# Altium project PDS Motherboard.PrjPcb
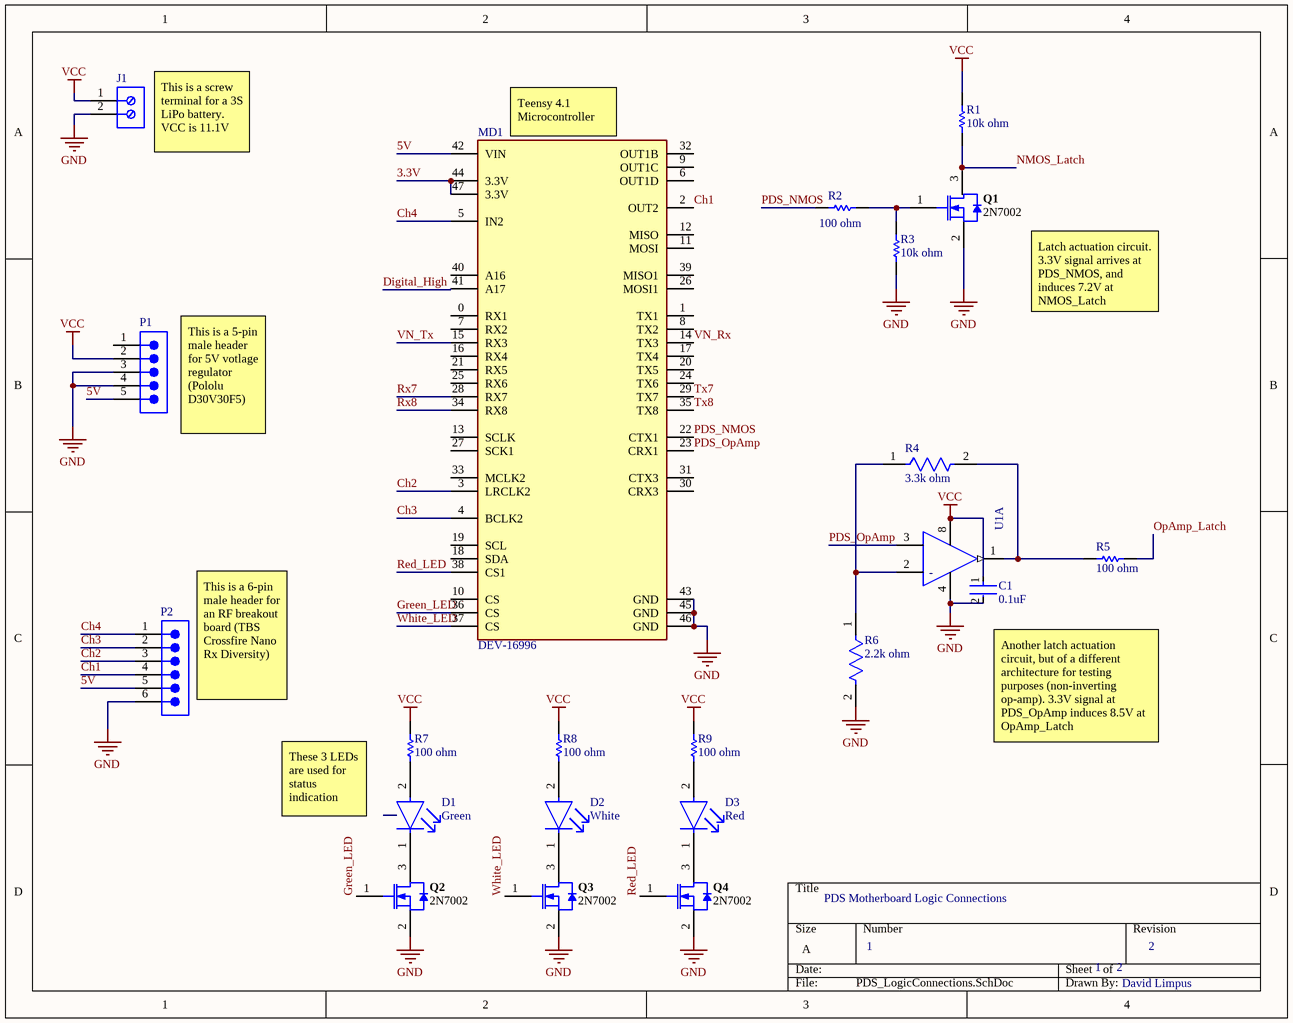
[diagram p0: PDS_LogicConnections.SchDoc]
2 sheets, 31 parts. Net scope: global (net labels, ports and power ports of the same name join across sheets).
Board file: PCB1.~(98).PcbDoc
Sheets:
  PDS_LogicConnections.SchDoc
  PDS_JSTConnections.SchDoc

## Sheet PDS_LogicConnections.SchDoc: PDS Motherboard Logic Connections
size A; DrawnBy: David Limpus; Revision: 2; SheetNumber: 1; SheetTotal: 2

### Parts
C1  0.1uF  [FP-C0603C-CF-MFG]
D1  Green  [FP-LTST-C190GKT-MFG]
D2  White  [FP-LTW-C191DS5-MFG]
D3  Red  [FP-LTST-C190EKT-MFG]
J1  1725656  [PHOE-1725656-2]  (value not drawn)
MD1  DEV-16996  [FP-DEV-16996-MFG]
P1  61300511121  [61300511121]  (value not drawn)
P2  61300611121  [61300611121]  (value not drawn)
Q1  2N7002  [INF-PG-SOT23_M]
Q2  2N7002  [INF-PG-SOT23_M]
Q3  2N7002  [INF-PG-SOT23_M]
Q4  2N7002  [INF-PG-SOT23_M]
R1  10k ohm  [RESC1609X50X30NL8T20]
R2  100 ohm  [RESC1609X50X30ML8T20]
R3  10k ohm  [RESC1609X50X30NL8T20]
R4  3.3k ohm  [FP-RG1608-MFG]
R5  100 ohm  [RESC1609X50X30ML8T20]
R6  2.2k ohm  [FP-RT0603-MFG]
R7  100 ohm  [RESC1609X50X30ML8T20]
R8  100 ohm  [RESC1609X50X30ML8T20]
R9  100 ohm  [RESC1609X50X30ML8T20]
U1  LM358DR  [FP-D0008A-MFG]  (value not drawn)  (part A of 2)

### Nets
GND: C1.2 J1.2 MD1.43(GND) MD1.45(GND) MD1.46(GND) P1.3 P1.4 P2.6 Q1.2(SOURCE) Q2.2(SOURCE) Q3.2(SOURCE) Q4.2(SOURCE) R3.2 R6.2 U1.4(V-)
VCC: C1.1 J1.1 P1.2 R1.1 R7.1 R8.1 R9.1 U1.8(V+)
3.3V: MD1.44(3.3V) MD1.47(3.3V)
5V: MD1.42(VIN) P1.5 P2.5
Ch1: MD1.2(OUT2) P2.4
Ch2: MD1.3(LRCLK2) P2.3
Ch3: MD1.4(BCLK2) P2.2
Ch4: MD1.5(IN2) P2.1
Digital_High: MD1.41(A17)
Green_LED: MD1.36(CS) Q2.1(GATE)
NMOS_Latch: Q1.3(DRAIN) R1.2
OpAmp_Latch: R5.2
PDS_NMOS: MD1.22(CTX1) R2.1
PDS_OpAmp: MD1.23(CRX1) U1.3(IN1+)
Red_LED: MD1.38(CS1) Q4.1(GATE)
Rx7: MD1.28(RX7)
Rx8: MD1.34(RX8)
Tx7: MD1.29(TX7)
Tx8: MD1.35(TX8)
VN_Rx: MD1.14(TX3)
VN_Tx: MD1.15(RX3)
White_LED: MD1.37(CS) Q3.1(GATE)
NetD1_1: D1.1(C) Q2.3(DRAIN)
NetD1_2: D1.2(A) R7.2
NetD2_1: D2.1(C) Q3.3(DRAIN)
NetD2_2: D2.2(A) R8.2
NetD3_1: D3.1(C) Q4.3(DRAIN)
NetD3_2: D3.2(A) R9.2
NetQ1_1: Q1.1(GATE) R2.2 R3.1
NetR4_1: R4.1 R6.1 U1.2(IN1-)
NetR4_2: R4.2 R5.1 U1.1(1OUT)

Not connected (* = marked no-connect by the designer): MD1 0(RX1) 1(TX1) 6(OUT1D) 7(RX2) 8(TX2) 9(OUT1C) 10(CS) 11(MOSI) 12(MISO) 13(SCLK) 16(RX4) 17(TX4) 18(SDA) 19(SCL) 20(TX5) 21(RX5) 24(TX6) 25(RX6) 26(MOSI1) 27(SCK1) 30(CRX3) 31(CTX3) 32(OUT1B) 33(MCLK2) 39(MISO1) 40(A16); P1 1

### Notes on the sheet
- (near J1) This is a screw terminal for a 3S LiPo battery. VCC is 11.1V
- (near MD1) Teensy 4.1 Microcontroller
- Latch actuation circuit. 3.3V signal arrives at PDS_NMOS, and induces 7.2V at NMOS_Latch
- (near P1) This is a 5-pin male header for 5V votlage regulator (Pololu D30V30F5)
- (near P2) This is a 6-pin male header for an RF breakout board (TBS Crossfire Nano Rx Diversity)
- (near C1) Another latch actuation circuit, but of a different architecture for testing purposes (non-inverting op-amp). 3.3V signal at PDS_OpAmp induces 8.5V at OpAmp_Latch
- These 3 LEDs are used for status indication
- PDS Motherboard Logic Connections
- 1
- 2
- David Limpus
- (in symbol CMP-1685-00009-2, part A) -

### Library data of the parts
C1 = CMP-2006-03061-2: CAP CER 0.1UF 50V X7R 0603; Manufacturer: KEMET; Manufacturer Part Number: C0603C104K5RACTU; Tolerance: 0.1; Temperature Coefficient: 30ppm/°C; Material: Ceramic; Automotive Grade: Grade 1; Value: 0.10 μF; Temperature: -55°C to +125°C; RoHS: TRUE; Temperature Range High: +125°C; Lead Free: Yes; Octopart: https://octopart.com/c0603c104k5ractu-kemet-139244; Digikey Description: CAP CER 0.1UF 50V X7R 0603; Category: Cap; Package: C0603C-CF; ComponentLink2Description: Datasheet; Temperature Range Low: -55°C; Device Class L1: Passive Components; Voltage Rating: 50 V; Automotive: Yes; Device Class L3: Ceramic Capacitors; ComponentLink2URL: https://api.kemet.com/component-edge/download/datasheet/C0603C100J5GACAUTO.pdf; Capacitance: 0.10 μF; Device Class L2: Capacitors; Temperature Characteristic: X7R; Height: 0.87mm
D1 = CMP-22017-000005-2: LED GREEN CLEAR CHIP SMD; Dominant Wavelength: 569nm; Reverse Voltage: 5V; Lens Color: Colorless; Viewing Angle: 130°; Voltage: 2V; Forward Current: 30mA; Power Dissipation: 100mW; Luminous Intensity: 6mcd; Number of LEDs: 1; Forward Voltage: 2.1V; Wavelength: 565nm; Test Current: 10mA; Min Operating Temperature: -55°C; Lens Style: Clear; Mount: Surface Mount; Width: 0.8mm; Packaging: Tape and Reel; Lens Transparency: Clear; Case Code (Metric): 1608; Depth: 0.8mm; Case Code (Imperial): 0603; Case/Package: 0603; Number of Pins: 2; Max Operating Temperature: 85°C; Lead Free: Lead Free; Number of Elements: 1; Length: 1.6mm; Height: 0.8mm; Package Quantity: 1; Power Rating: 100mW; Radiation Hardening: No; Illumination Color: Green; Color: Green
D2 = CMP-22017-000001-1: LED WHITE CHIP SMD; Manufacturer Part Number: LTW-C191DS5; Manufacturer: Lite-On; Luminous Intensity: 71-180mcd; Forward Voltage: 3.15V; Led Orientation: Top View; Power Dissipation: 72mW; Forward Current: 20mA; Viewing Angle: 130°; Reverse Voltage: 5V; Device Class L3: unset; Category: Diode; Height: 0.65mm; Octopart: https://octopart.com/ltw-c191ds5-lite-on-9287539; Device Class L1: Optoelectronics; ComponentLink2URL: http://optoelectronics.liteon.com/upload/download/DS22-2006-062/LTW-C191DS5.PDF; Digikey Description: LED WHITE CHIP SMD; Colour: White; RoHS: TRUE; Temperature: -30°C to +85°C; Automotive: No; Lead Free: Yes; Temperature Range Low: -30°C; Device Class L2: LEDs; Package: LTW-C191DS5; Mouser Description: Standard LEDs - SMD White 65mcd; ComponentLink2Description: Datasheet; Temperature Range High: +85°C
D3 = CMP-22017-000021-1: LED RED CLEAR CHIP SMD; Power Dissipation: 100mW; Lens Color: Colorless; Viewing Angle: 130°; Wavelength: 630nm; Number of Elements: 1; Reverse Voltage: 5V; Forward Current: 30mA; Dominant Wavelength: 621nm; Luminous Intensity: 2mcd; Test Current: 10mA; Forward Voltage: 2V; Length: 1.6mm; Lead Free: Lead Free; Lens Transparency: Clear; Max Operating Temperature: 85°C; Case Code (Metric): 1608; Case Code (Imperial): 0603; Number of Pins: 2; Color: Red; Depth: 0.8mm; Lens Style: Clear; Packaging: Tape and Reel; Height: 0.8mm; Case/Package: 0603; Min Operating Temperature: -55°C; Number of LEDs: 1; Illumination Color: Red; Mount: Surface Mount; Package Quantity: 1; Max Power Dissipation: 100mW; Power Rating: 100mW; Width: 0.8mm; Radiation Hardening: No
J1 = CMP-2000-05299-1: Male Header, Pitch 2.54 mm, 1 x 2 Position, Height 9 mm, Tail Length 3.5 mm; Manufacturer: Phoenix Contact; Number of contacts: 2; Content: 250pc(s); Pitch: 2.54mm; Industrial packaging: Yes; Colour: Green; Manufacturer part No.: 1725656; Type: MPT0,5/2-2,54; Datasheet URL: http://datasheet.octopart.com/1725656-Phoenix-Contact-datasheet-5302866.pdf; Manufacturer URL: http://www.phoenixcontact.com/; Datasheet Version: Apr-08
MD1 = CMP-157412-000001-1: TEENSY 4.1 (HEADERS)
P1 = CMP-1502-01068-2: NexarPartId: 32855526; Operating Supply Voltage: 250V; Number of Contacts: 5; Connector Type: Male Pin; Current Rating: 3A; Contact Resistance: 20mΩ; Pitch: 2.54mm; Gender: Male; Termination: Solder; RoHS: Compliant; Lead Pitch: 2.54mm; Contact Mating Length: 5.9944mm; Number of Positions: 5; Lead Free: Lead Free; Contact Plating: Gold; Number of Pins: 5; Min Operating Temperature: -40°C; Voltage Rating: 250V; Color: Black; Mount: Through Hole; REACH SVHC: Unknown; Packaging: Bulk; Height: 8.89mm; Number of Rows: 1; Orientation: Vertical; Contact Material: Copper; Max Operating Temperature: 105°C
P2 = CMP-1502-01070-2: NexarPartId: 20084590; Operating Supply Voltage: 250V; Current Rating: 3A; Number of Contacts: 6; Gender: Male; Connector Type: Male Pin; Pitch: 2.54mm; Contact Resistance: 20mΩ; Lead Free: Lead Free; REACH SVHC: Unknown; Number of Rows: 1; Color: Black; Min Operating Temperature: -40°C; Contact Material: Copper; Lead Pitch: 2.54mm; Contact Plating: Gold; Number of Pins: 6; Height: 8.89mm; Orientation: Vertical; Termination: Through Hole; Mount: Through Hole; RoHS: Compliant; Contact Gender: Male; Contact Mating Length: 5.9944mm; Voltage Rating: 250V; Number of Positions: 6; Housing Material: PBT; Packaging: Bulk; Max Operating Temperature: 105°C
Q1-Q4 = CMP-1149-00026-1: N-Channel OptiMOS Small-Signal-Transistor, 60 V VDS, 0.3 A ID, -55 to 150 degC, PG-SOT23, Reel, Green; Manufacturer: Infineon; RDS (on) (max) (@4.5V): 4,000 mOhm; VDS (max): 60 V; IDpuls (max): 1.2Â A; QG: 0.4Â nC; RDS (on) (max): 3,000 mOhm; RthJA (max): 250 K/W; ID (max): 0.3Â A; VGS(th) (max): 2.5Â V; VGS(th) (min): 1.5Â V; Green: TRUE; Ptot (max): 0.5Â W; PackageDescription: 3-Pin Small Outline Transistor Package, 2.9 x 1.3 mm Body, 0.95 mm Pitch; Halogen-free: TRUE; ComponentLink2Description: Datasheet; ComponentLink1URL: http://www.infineon.com/; Packing: Reel; DatasheetVersion: Rev. 2.4; PartNumber: 2N7002; PackageReference: PG-SOT23; PackageVersion: Apr-08; ComponentLink3URL: http://www.infineon.com/dgdl/SOT23-Package_Overview.pdf?folderId=db3a30431936bc4b0119532290053c66&fileId=db3a30431936bc4b0119533468123c85; ComponentLink1Description: Manufacturer URL; Mounting Technology: Surface Mount; ComponentLink3Description: Package Specification; ComponentLink2URL: http://www.infineon.com/dgdl/2N7002_Rev2.4.pdf?folderId=db3a3043156fd573011622e10b5c1f67&fileId=db3a304319bc939a0119c2a9461e79e6
R1 R3 = CMP-1666-00005-4: Chip Resistor, 10 KOhm, +/- 1%, 100 mW, -55 to 155 degC, 0603 (1608 Metric), RoHS, Tape and Reel; Manufacturer: Vishay Semiconductor; Voltage Rating: 75 V; Max Operating Temperature: 155 degC; PackageDescription: 2-Pin Surface Mount Device, Body 1.575 x 0.85 mm; ComponentLink1Description: Manufacturer URL; RoHSCompliant: true; PackageReference: 0603; REACH SVHC: Unknown; Length: 1.55 mm; DatasheetVersion: 06/2012; Packaging: Tape and Reel; Min Operating Temperature: -55 degC; Mounting Technology: Surface Mount; ComponentLink2URL: https://datasheet.ciiva.com/11809/0900766b80d98afc-11809037.pdf; Height: 0.45 mm; ComponentLink2Description: Datasheet; Package Quantity: 5000; ComponentLink1URL: http://www.vishay.com/
R2 R5 R7-R9 = CMP-2000-03824-5: Chip Resistor, 100 Ohm, +/- 1%, 100 mW,-55 to 155 degC, 0603 (1608 Metric), RoHS, Tape and Ree; Manufacturer: Vishay Semiconductor; ComponentLink2URL: http://www.vishay.com/docs/20035/dcrcwe3.pdf; ComponentLink1URL: http://www.vishay.com/; Mounting Technology: Surface Mount; ComponentLink1Description: Manufacturer URL; ComponentLink2Description: Datasheet; PackageDescription: 2-Pin Surface Mount Device, Body 1.575 x 0.85 mm; PackageReference: 0603; DatasheetVersion: 06/2012
R4 = CMP-2000-02202-2: Automotive Metal Thin Film Chip Resistor, 0603, 3.3kΩ, 0.1%, 25ppm/°C, 0.1W, 100V; Max Power Dissipation: 100mW; Resistance: 3.3kR; Voltage Rating (DC): 75V; Lead Free: Lead Free; Features: Automotive AEC-Q200; Resistor Type: Thin Film; Number of Terminations: 2; Case Code (Metric): 1608; Voltage Rating: 100V; Case/Package: 0603; RoHS Compliant: Yes; Termination: SMD/SMT; Series: RG; Packaging: Tape and Reel; Min Operating Temperature: -55°C; Case Code (Imperial): 0603; Power Rating: 100mW; Package Quantity: 1; Height: 0.02inch; Max Operating Temperature: 155°C; Weight: 7.1E-05oz; Length: 0.063inch; Temperature Coefficient: 25ppm/°C; Width: 0.031inch; Tolerance: 0.1%
R6 = CMP-03412-033768-1: RES SMD 2.2K OHM 1% 1/10W 0603; Manufacturer: Yageo; Manufacturer Part Number: RT0603FRE072K2L; Temperature Coefficient: 50 ppm/°C; Power Rating: 0.1W; Value: 2.2KΩ; Tolerance: 0.01; Voltage Rating: 75V; Package: RT0603; Digikey Description: RES SMD 2.2K OHM 1% 1/10W 0603; Octopart: https://octopart.com/rt0603fre072k2l-yageo-40019811; ComponentLink2URL: http://www.yageo.com/documents/recent/PYu-RT_1-to-0.01_RoHS_L_9.pdf; Temperature Range Low: -55°C; Height: 0.55mm; Footprint Url: http://www.yageo.com/exep/pages/download/literatures/PYu-R_Mount_10.pdf; ComponentLink2Description: Datasheet; Device Class L1: Passive Components; RoHS: TRUE; Device Class L3: Chip SMD Resistors; Composition: Thin Film; Device Class L2: Resistors; Mouser Description: High Precision-High Stability Chip Resistor Thin Film 0603 2.2kOhm 1% Paper T/R; Automotive: No; Category: Res; Temperature Range High: +155°C; Lead Free: Yes; Resistance: 2.2KΩ; Temperature: -55°C to +155°C; Series: RT; Ipc Land Pattern Name: RESC16080X45
U1 = CMP-1685-00009-2: IC OPAMP GP 2 CIRCUIT 8SOIC; Output Current: 30mA; Min Dual Supply Voltage: 1.5V; Input Offset Voltage (Vos): 7mV; Power Supply Rejection Ratio (PSRR): 65dB; Unity Gain Bandwidth Product: 700kHz; Number of Channels: 2; Min Supply Voltage: 3V; Max Dual Supply Voltage: 16V; Dual Supply Voltage: 9V; Max Supply Voltage: 32V; Nominal Supply Current: 1.2mA; Slew Rate: 0.3V/µs; Input Bias Current: 250nA; Voltage Gain: 100dB; Operating Supply Current: 1mA; REACH SVHC: No SVHC; Package Quantity: 2500; Width: 3.91mm; Max Operating Temperature: 70°C; Min Operating Temperature: 0°C; Mount: Surface Mount; Length: 4.9mm; Radiation Hardening: No; Case/Package: SOIC; Lead Free: Lead Free; Number of Elements: 2; Packaging: Tape and Reel; Output Current per Channel: 30mA; Number of Circuits: 2; Bandwidth: 700kHz; Operating Supply Voltage: 16V; Gain Bandwidth Product: 700kHz; Number of Pins: 8; Number of Amplifiers: 2; Height: 1.58mm; Common Mode Rejection Ratio: 65dB; Contact Plating: Gold

## Sheet PDS_JSTConnections.SchDoc
size A; SheetNumber: 2; SheetTotal: 2
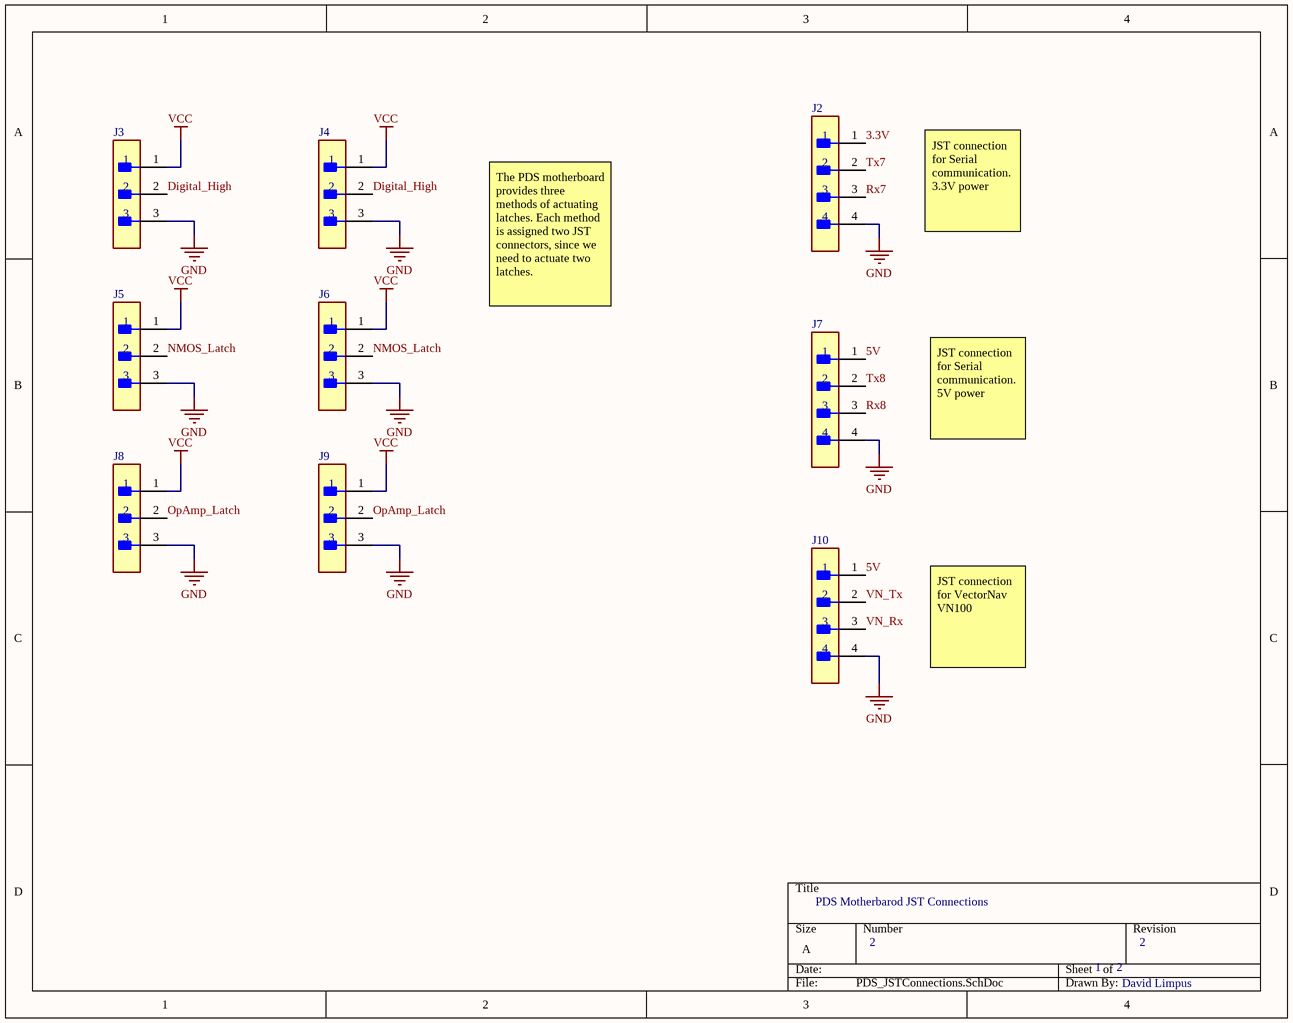
[diagram p1: PDS_JSTConnections.SchDoc]

### Parts
J2  B04B-XASK-1-A(LF)(SN)  [FP-B04B-XASK-1-A_LF_SN-MFG]  (value not drawn)
J3  B03B-XASK-1-A(LF)(SN)  [FP-B03B-XASK-1-A_LF_SN-MFG]  (value not drawn)
J4  B03B-XASK-1-A(LF)(SN)  [FP-B03B-XASK-1-A_LF_SN-MFG]  (value not drawn)
J5  B03B-XASK-1-A(LF)(SN)  [FP-B03B-XASK-1-A_LF_SN-MFG]  (value not drawn)
J6  B03B-XASK-1-A(LF)(SN)  [FP-B03B-XASK-1-A_LF_SN-MFG]  (value not drawn)
J7  B04B-XASK-1-A(LF)(SN)  [FP-B04B-XASK-1-A_LF_SN-MFG]  (value not drawn)
J8  B03B-XASK-1-A(LF)(SN)  [FP-B03B-XASK-1-A_LF_SN-MFG]  (value not drawn)
J9  B03B-XASK-1-A(LF)(SN)  [FP-B03B-XASK-1-A_LF_SN-MFG]  (value not drawn)
J10  B04B-XASK-1-A(LF)(SN)  [FP-B04B-XASK-1-A_LF_SN-MFG]  (value not drawn)

### Nets
GND: J2.4 J3.3 J4.3 J5.3 J6.3 J7.4 J8.3 J9.3 J10.4
VCC: J3.1 J4.1 J5.1 J6.1 J8.1 J9.1
3.3V: J2.1
5V: J7.1 J10.1
Digital_High: J3.2 J4.2
NMOS_Latch: J5.2 J6.2
OpAmp_Latch: J8.2 J9.2
Rx7: J2.3
Rx8: J7.3
Tx7: J2.2
Tx8: J7.2
VN_Rx: J10.3
VN_Tx: J10.2

### Notes on the sheet
- JST connection for Serial communication. 3.3V power
- The PDS motherboard provides three methods of actuating latches. Each method is assigned two JST connectors, since we need to actuate two latches.
- JST connection for Serial communication. 5V power
- JST connection for VectorNav VN100
- PDS Motherbarod JST Connections
- 2
- 1
- David Limpus

### Library data of the parts
J2 J7 J10 = CMP-2000-05878-2: CONN HEADER VERT POS 2.5MM; Number of Positions: 4; Mated Stacking Heights: 11.3mm; Voltage Rating: 250V; Lead Free: Lead Free; Series: XA; Flammability Rating: UL94 V-0; Contact Shape: Circular; Packaging: Bulk; Connector Type: Header; Insulation Color: Natural; Termination: Press-Fit; Contact Type: Male Pin; Pitch: 2.5mm; Insulation Material: Nylon; Contact Material: Copper Alloy; Fastening Type: Ramp; Mount: Through Hole; Number of Rows: 1; Contact Finish - Mating: TIN
J3-J6 J8 J9 = CMP-17439-000540-1: CONN HEADER VERT 3POS 2.5MM; Number of Positions: 3; Voltage Rating: 250V; Mated Stacking Heights: 11.3mm; Contact Shape: Circular; Pitch: 2.5mm; Lead Free: Lead Free; Connector Type: Header; Flammability Rating: UL94 V-0; Contact Material: Copper Alloy; Packaging: Bulk; Insulation Color: Natural; Fastening Type: Ramp; Contact Type: Male Pin; Series: XA; Termination: Press-Fit; Contact Finish - Mating: TIN; Insulation Material: Nylon; Number of Rows: 1; Mount: Through Hole

## Nets that join several sheets
GND: PDS_LogicConnections (15 pins), PDS_JSTConnections (9 pins)
VCC: PDS_LogicConnections (8 pins), PDS_JSTConnections (6 pins)
3.3V: PDS_LogicConnections (MD1.44 MD1.47), PDS_JSTConnections (J2.1)
5V: PDS_LogicConnections (MD1.42 P1.5 P2.5), PDS_JSTConnections (J7.1 J10.1)
Digital_High: PDS_LogicConnections (MD1.41), PDS_JSTConnections (J3.2 J4.2)
NMOS_Latch: PDS_LogicConnections (Q1.3 R1.2), PDS_JSTConnections (J5.2 J6.2)
OpAmp_Latch: PDS_LogicConnections (R5.2), PDS_JSTConnections (J8.2 J9.2)
Rx7: PDS_LogicConnections (MD1.28), PDS_JSTConnections (J2.3)
Rx8: PDS_LogicConnections (MD1.34), PDS_JSTConnections (J7.3)
Tx7: PDS_LogicConnections (MD1.29), PDS_JSTConnections (J2.2)
Tx8: PDS_LogicConnections (MD1.35), PDS_JSTConnections (J7.2)
VN_Rx: PDS_LogicConnections (MD1.14), PDS_JSTConnections (J10.3)
VN_Tx: PDS_LogicConnections (MD1.15), PDS_JSTConnections (J10.2)